# Altium schematic sheet Amp-DAQ.SchDoc
size A4; SheetNumber: 1; SheetTotal: 2
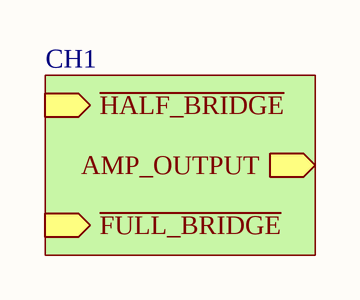
[diagram p0: Amp-DAQ.SchDoc]

## Sub-sheets
CH1 = Quarter to Full Bridge Strain Gauge Amplifier: ~{HALF_BRIDGE} (in), ~{FULL_BRIDGE} (in), AMP_OUTPUT (out)